# Altium schematic sheet Top Level.SchDoc: Top Level Schematic
size A; DrawnBy: LSG; SheetNumber: 1; SheetTotal: 3
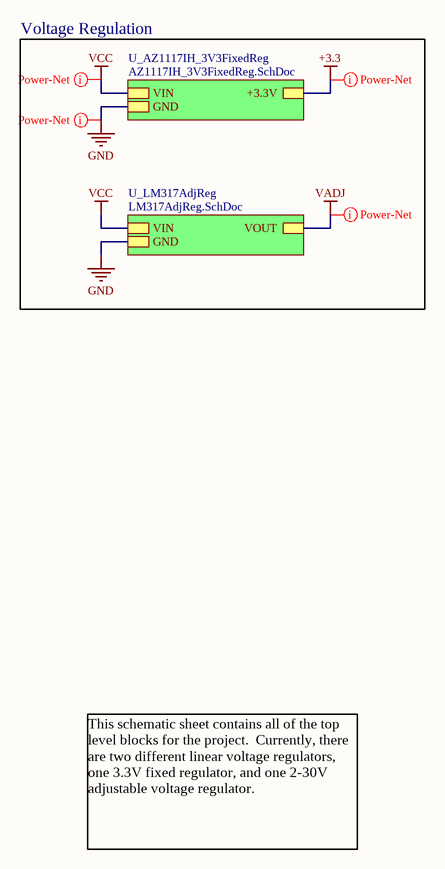
[diagram p0: Top Level.SchDoc]

## Sub-sheets
U_AZ1117IH_3V3FixedReg = AZ1117IH_3V3FixedReg.SchDoc: VIN, +3.3V, GND
U_LM317AdjReg = LM317AdjReg.SchDoc: VIN, VOUT, GND

## Nets
+3.3: sheet U_AZ1117IH_3V3FixedReg/+3.3V
GND: sheet U_LM317AdjReg/GND, sheet U_AZ1117IH_3V3FixedReg/GND
VADJ: sheet U_LM317AdjReg/VOUT
VCC: sheet U_LM317AdjReg/VIN, sheet U_AZ1117IH_3V3FixedReg/VIN

## Layout directives
net class Power-Net: +3.3, GND, VADJ, VCC

## Notes on the sheet
- Voltage Regulation
- This schematic sheet contains all of the top level blocks for the project.  Currently, there are two different linear voltage regulators, one 3.3V fixed regulator, and one 2-30V adjustable voltage regulator.